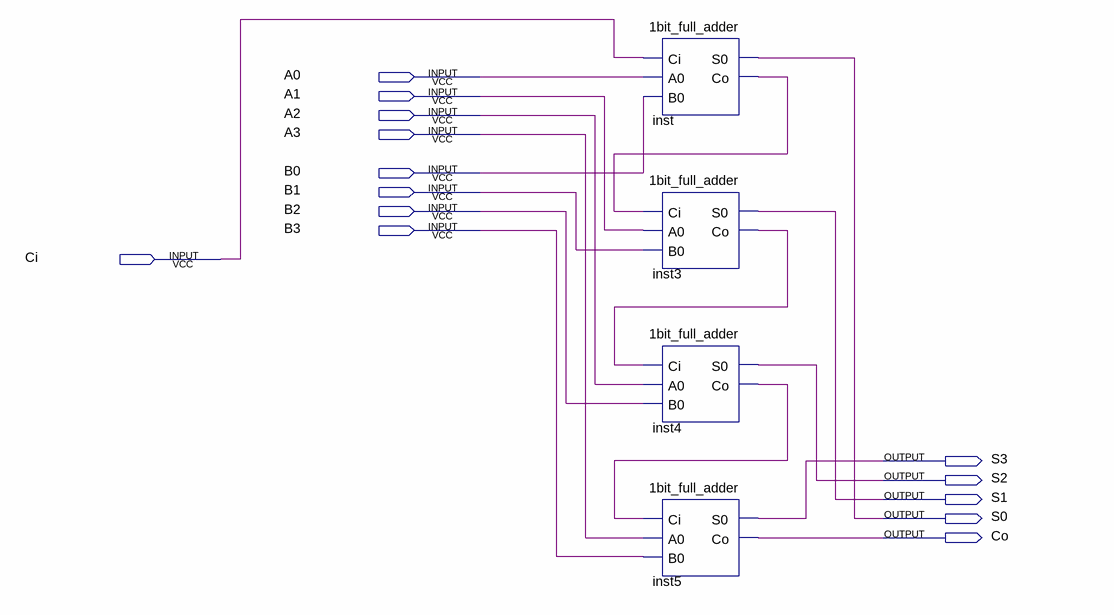
[diagram p0: schematic sheet]
// Quartus schematic 4bit_full_adder.bdf as structural Verilog: 4 symbols, 14 pins
module \4bit_full_adder  (
  input  A0,
  input  A1,
  input  A2,
  input  A3,
  input  B0,
  input  B1,
  input  B2,
  input  B3,
  input  Ci,
  output S3,
  output S2,
  output S1,
  output S0,
  output Co
);

  wire inst3_co, inst4_co, inst_co;

  \1bit_full_adder  inst (.Ci(Ci), .A0(A0), .B0(B0), .S0(S0), .Co(inst_co));
  \1bit_full_adder  inst3 (.Ci(inst_co), .A0(A1), .B0(B1), .S0(S1), .Co(inst3_co));
  \1bit_full_adder  inst4 (.Ci(inst3_co), .A0(A2), .B0(B2), .S0(S2), .Co(inst4_co));
  \1bit_full_adder  inst5 (.Ci(inst4_co), .A0(A3), .B0(B3), .S0(S3), .Co(Co));
endmodule
